# EAGLE design breakout (EAGLE 9.4.2)
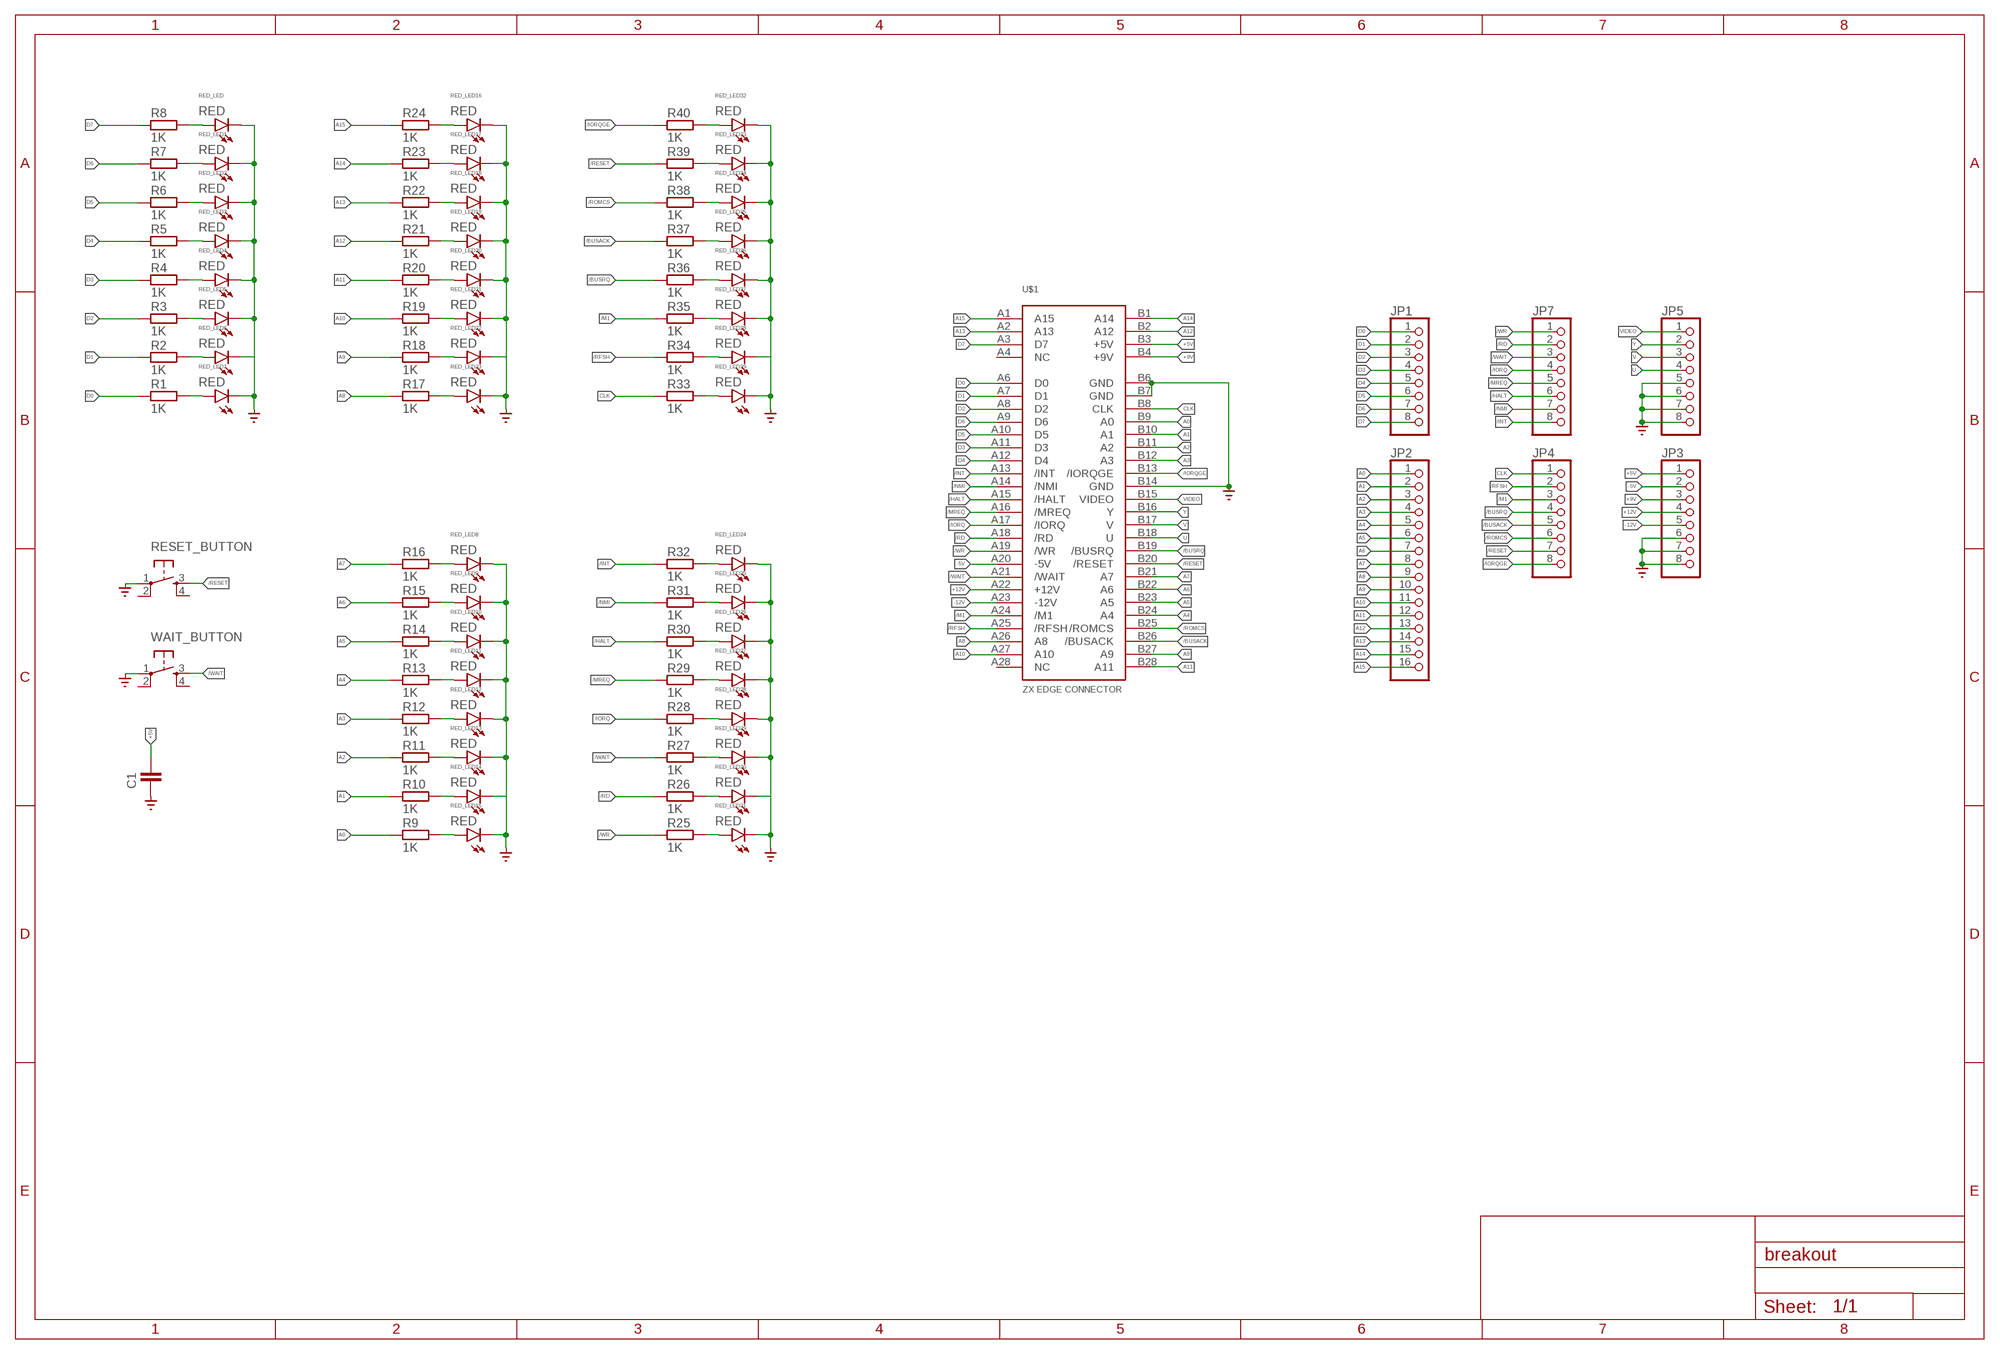
[diagram p0: schematic, sheet 1]

## Parts
C1  1u  C-EUC0402  [C0402]
JP1  PINHD-1X8  [1X08]
JP2  PINHD-1X16  [1X16]
JP3  PINHD-1X8  [1X08]
JP4  PINHD-1X8  [1X08]
JP5  PINHD-1X8  [1X08]
JP7  PINHD-1X8  [1X08]
R1  1K  R-EU_R0402  [R0402]
R2  1K  R-EU_R0402  [R0402]
R3  1K  R-EU_R0402  [R0402]
R4  1K  R-EU_R0402  [R0402]
R5  1K  R-EU_R0402  [R0402]
R6  1K  R-EU_R0402  [R0402]
R7  1K  R-EU_R0402  [R0402]
R8  1K  R-EU_R0402  [R0402]
R9  1K  R-EU_R0402  [R0402]
R10  1K  R-EU_R0402  [R0402]
R11  1K  R-EU_R0402  [R0402]
R12  1K  R-EU_R0402  [R0402]
R13  1K  R-EU_R0402  [R0402]
R14  1K  R-EU_R0402  [R0402]
R15  1K  R-EU_R0402  [R0402]
R16  1K  R-EU_R0402  [R0402]
R17  1K  R-EU_R0402  [R0402]
R18  1K  R-EU_R0402  [R0402]
R19  1K  R-EU_R0402  [R0402]
R20  1K  R-EU_R0402  [R0402]
R21  1K  R-EU_R0402  [R0402]
R22  1K  R-EU_R0402  [R0402]
R23  1K  R-EU_R0402  [R0402]
R24  1K  R-EU_R0402  [R0402]
R25  1K  R-EU_R0402  [R0402]
R26  1K  R-EU_R0402  [R0402]
R27  1K  R-EU_R0402  [R0402]
R28  1K  R-EU_R0402  [R0402]
R29  1K  R-EU_R0402  [R0402]
R30  1K  R-EU_R0402  [R0402]
R31  1K  R-EU_R0402  [R0402]
R32  1K  R-EU_R0402  [R0402]
R33  1K  R-EU_R0402  [R0402]
R34  1K  R-EU_R0402  [R0402]
R35  1K  R-EU_R0402  [R0402]
R36  1K  R-EU_R0402  [R0402]
R37  1K  R-EU_R0402  [R0402]
R38  1K  R-EU_R0402  [R0402]
R39  1K  R-EU_R0402  [R0402]
R40  1K  R-EU_R0402  [R0402]
RED_LED  RED  LEDCHIPLED_0603  [CHIPLED_0603]
RED_LED1  RED  LEDCHIPLED_0603  [CHIPLED_0603]
RED_LED2  RED  LEDCHIPLED_0603  [CHIPLED_0603]
RED_LED3  RED  LEDCHIPLED_0603  [CHIPLED_0603]
RED_LED4  RED  LEDCHIPLED_0603  [CHIPLED_0603]
RED_LED5  RED  LEDCHIPLED_0603  [CHIPLED_0603]
RED_LED6  RED  LEDCHIPLED_0603  [CHIPLED_0603]
RED_LED7  RED  LEDCHIPLED_0603  [CHIPLED_0603]
RED_LED8  RED  LEDCHIPLED_0603  [CHIPLED_0603]
RED_LED9  RED  LEDCHIPLED_0603  [CHIPLED_0603]
RED_LED10  RED  LEDCHIPLED_0603  [CHIPLED_0603]
RED_LED11  RED  LEDCHIPLED_0603  [CHIPLED_0603]
RED_LED12  RED  LEDCHIPLED_0603  [CHIPLED_0603]
RED_LED13  RED  LEDCHIPLED_0603  [CHIPLED_0603]
RED_LED14  RED  LEDCHIPLED_0603  [CHIPLED_0603]
RED_LED15  RED  LEDCHIPLED_0603  [CHIPLED_0603]
RED_LED16  RED  LEDCHIPLED_0603  [CHIPLED_0603]
RED_LED17  RED  LEDCHIPLED_0603  [CHIPLED_0603]
RED_LED18  RED  LEDCHIPLED_0603  [CHIPLED_0603]
RED_LED19  RED  LEDCHIPLED_0603  [CHIPLED_0603]
RED_LED20  RED  LEDCHIPLED_0603  [CHIPLED_0603]
RED_LED21  RED  LEDCHIPLED_0603  [CHIPLED_0603]
RED_LED22  RED  LEDCHIPLED_0603  [CHIPLED_0603]
RED_LED23  RED  LEDCHIPLED_0603  [CHIPLED_0603]
RED_LED24  RED  LEDCHIPLED_0603  [CHIPLED_0603]
RED_LED25  RED  LEDCHIPLED_0603  [CHIPLED_0603]
RED_LED26  RED  LEDCHIPLED_0603  [CHIPLED_0603]
RED_LED27  RED  LEDCHIPLED_0603  [CHIPLED_0603]
RED_LED28  RED  LEDCHIPLED_0603  [CHIPLED_0603]
RED_LED29  RED  LEDCHIPLED_0603  [CHIPLED_0603]
RED_LED30  RED  LEDCHIPLED_0603  [CHIPLED_0603]
RED_LED31  RED  LEDCHIPLED_0603  [CHIPLED_0603]
RED_LED32  RED  LEDCHIPLED_0603  [CHIPLED_0603]
RED_LED33  RED  LEDCHIPLED_0603  [CHIPLED_0603]
RED_LED34  RED  LEDCHIPLED_0603  [CHIPLED_0603]
RED_LED35  RED  LEDCHIPLED_0603  [CHIPLED_0603]
RED_LED36  RED  LEDCHIPLED_0603  [CHIPLED_0603]
RED_LED37  RED  LEDCHIPLED_0603  [CHIPLED_0603]
RED_LED38  RED  LEDCHIPLED_0603  [CHIPLED_0603]
RED_LED39  RED  LEDCHIPLED_0603  [CHIPLED_0603]
RESET_BUTTON  10-XX  [B3F-10XX-3D]
U$1  ZX-SPECTRUM-EDGE-CONNECTOR  [ZX-SPECTRUM-EDGE-CONNECTOR]
WAIT_BUTTON  10-XX  [B3F-10XX-3D]

## Nets
+5V: C1.1 JP3.1 U$1.B3(+5V)
+9V: JP3.3 U$1.B4(+9V)
+12V: JP3.4 U$1.A22(+12V)
-5V: JP3.2 U$1.A20(-5V)
-12V: JP3.5 U$1.A23(-12V)
/BUSACK: JP4.5 R37.1 U$1.B26(/BUSACK)
/BUSRQ: JP4.4 R36.1 U$1.B19(/BUSRQ)
/HALT: JP7.6 R30.1 U$1.A15(/HALT)
/INT: JP7.8 R32.1 U$1.A13(/INT)
/IORQ: JP7.4 R28.1 U$1.A17(/IORQ)
/IORQGE: JP4.8 R40.1 U$1.B13(/IORQGE)
/M1: JP4.3 R35.1 U$1.A24(/M1)
/MREQ: JP7.5 R29.1 U$1.A16(/MREQ)
/NMI: JP7.7 R31.1 U$1.A14(/NMI)
/RD: JP7.2 R26.1 U$1.A18(/RD)
/RESET: JP4.7 R39.1 RESET_BUTTON.3(S) U$1.B20(/RESET)
/RFSH: JP4.2 R34.1 U$1.A25(/RFSH)
/ROMCS: JP4.6 R38.1 U$1.B25(/ROMCS)
/WAIT: JP7.3 R27.1 U$1.A21(/WAIT) WAIT_BUTTON.3(S)
/WR: JP7.1 R25.1 U$1.A19(/WR)
A0: JP2.1 R9.1 U$1.B9(A0)
A1: JP2.2 R10.1 U$1.B10(A1)
A2: JP2.3 R11.1 U$1.B11(A2)
A3: JP2.4 R12.1 U$1.B12(A3)
A4: JP2.5 R13.1 U$1.B24(A4)
A5: JP2.6 R14.1 U$1.B23(A5)
A6: JP2.7 R15.1 U$1.B22(A6)
A7: JP2.8 R16.1 U$1.B21(A7)
A8: JP2.9 R17.1 U$1.A26(A8)
A9: JP2.10 R18.1 U$1.B27(A9)
A10: JP2.11 R19.1 U$1.A27(A10)
A11: JP2.12 R20.1 U$1.B28(A11)
A12: JP2.13 R21.1 U$1.B2(A12)
A13: JP2.14 R22.1 U$1.A2(A13)
A14: JP2.15 R23.1 U$1.B1(A14)
A15: JP2.16 R24.1 U$1.A1(A15)
CLK: JP4.1 R33.1 U$1.B8(CLK)
D0: JP1.1 R1.1 U$1.A6(D0)
D1: JP1.2 R2.1 U$1.A7(D1)
D2: JP1.3 R3.1 U$1.A8(D2)
D3: JP1.4 R4.1 U$1.A11(D3)
D4: JP1.5 R5.1 U$1.A12(D4)
D5: JP1.6 R6.1 U$1.A10(D5)
D6: JP1.7 R7.1 U$1.A9(D6)
D7: JP1.8 R8.1 U$1.A3(D7)
GND: C1.2 JP3.6 JP3.7 JP3.8 JP5.5 JP5.6 JP5.7 JP5.8 RED_LED1.C RED_LED2.C RED_LED3.C RED_LED4.C RED_LED5.C RED_LED6.C RED_LED7.C RED_LED8.C RED_LED9.C RED_LED10.C RED_LED11.C RED_LED12.C RED_LED13.C RED_LED14.C RED_LED15.C RED_LED16.C RED_LED17.C RED_LED18.C RED_LED19.C RED_LED20.C RED_LED21.C RED_LED22.C RED_LED23.C RED_LED24.C RED_LED25.C RED_LED26.C RED_LED27.C RED_LED28.C RED_LED29.C RED_LED30.C RED_LED31.C RED_LED32.C RED_LED33.C RED_LED34.C RED_LED35.C RED_LED36.C RED_LED37.C RED_LED38.C RED_LED39.C RED_LED.C RESET_BUTTON.1(P) U$1.B6(GND) U$1.B7(GND) U$1.B14(GND) WAIT_BUTTON.1(P) ; supply symbol labelled SUPPLY0_GND_
N$1: R8.2 RED_LED.A
N$2: R7.2 RED_LED1.A
N$3: R6.2 RED_LED2.A
N$4: R5.2 RED_LED3.A
N$5: R4.2 RED_LED4.A
N$6: R3.2 RED_LED5.A
N$7: R2.2 RED_LED6.A
N$8: R1.2 RED_LED7.A
N$9: R16.2 RED_LED8.A
N$10: R15.2 RED_LED9.A
N$11: R14.2 RED_LED10.A
N$12: R13.2 RED_LED11.A
N$13: R12.2 RED_LED12.A
N$14: R11.2 RED_LED13.A
N$15: R10.2 RED_LED14.A
N$16: R9.2 RED_LED15.A
N$17: R24.2 RED_LED16.A
N$18: R23.2 RED_LED17.A
N$19: R22.2 RED_LED18.A
N$20: R21.2 RED_LED19.A
N$21: R20.2 RED_LED20.A
N$22: R19.2 RED_LED21.A
N$23: R18.2 RED_LED22.A
N$24: R17.2 RED_LED23.A
N$25: R32.2 RED_LED24.A
N$26: R31.2 RED_LED25.A
N$27: R30.2 RED_LED26.A
N$28: R29.2 RED_LED27.A
N$29: R28.2 RED_LED28.A
N$30: R27.2 RED_LED29.A
N$31: R26.2 RED_LED30.A
N$32: R25.2 RED_LED31.A
N$33: R40.2 RED_LED32.A
N$34: R39.2 RED_LED33.A
N$35: R38.2 RED_LED34.A
N$36: R37.2 RED_LED35.A
N$37: R36.2 RED_LED36.A
N$38: R35.2 RED_LED37.A
N$39: R34.2 RED_LED38.A
N$40: R33.2 RED_LED39.A
U: JP5.4 U$1.B18(U)
V: JP5.3 U$1.B17(V)
VIDEO: JP5.1 U$1.B15(VIDEO)
Y: JP5.2 U$1.B16(Y)
Unconnected: RESET_BUTTON.2(P1) RESET_BUTTON.4(S1) U$1.A4(NC) U$1.A28(NC) WAIT_BUTTON.2(P1) WAIT_BUTTON.4(S1)

## Library data of the parts
C1 = resistors-scott:C-EU: CAPACITOR, European symbol; SPICEPREFIX: C
JP1 JP3-JP5 JP7 = pinhead:PINHD-1X8: PIN HEADER
JP2 = pinhead:PINHD-1X16: PIN HEADER
R1-R40 = rcl:R-EU_: RESISTOR, European symbol; SPICEPREFIX: R
RED_LED RED_LED1-RED_LED39 = led:LED: LED OSRAM: - CHIPLED LG R971, LG N971, LY N971, LG Q971, LY Q971, LO R971, LY R971 LH N974, LH R974 LS Q976, LO Q976, LY Q976 LO Q996 - Hyper CHIPLED LW Q18S LB Q993, LB Q99A, LB R99A - SideLED LS A670, LO A670, LY A670, LG A670, LP A670 LB A673, LV A673, LT A673, LW A673 LH A674 LY A675 LS A676, LA A676, LO A676, LY A676, LW A676 LS A679, LY A679, LG A679 - Hyper Micro SIDELED® LS Y876, LA Y876, LO Y876, LY Y876 LT Y87S - SmartLED LW L88C, LW L88S LB L89C, LB L89S, LG L890 LS L89K, LO L89K, LY L89K LS L896, LA L896, LO L896, LY L896 - TOPLED LS T670, LO T670, LY T670, LG T670, LP T670 LSG T670, LSP T670, LSY T670, LOP T670, LYG T670 LG T671, LOG T671, LSG T671 LB T673, LV T673, LT T673, LW T673 LH T674 LS T676, LA T676, LO T676, LY T676, LB T676, LH T676, LSB T676, LW T676 LB T67C, LV T67C, LT T67C, LS T67K, LO T67K, LY T67K, LW E67C LS E67B, LA E67B, LO E67B, LY E67B, LB E67C, LV E67C, LT E67C LW T67C LS T679, LY T679, LG T679 LS T770, LO T770, LY T770, LG T770, LP T770 LB T773, LV T773, LT T773, LW T773 LH T774 LS E675, LA E675, LY E675, LS T675 LS T776, LA T776, LO T776, LY T776, LB T776 LHGB T686 LT T68C, LB T68C - Hyper Mini TOPLED® LB M676 - Mini TOPLED Santana® LG M470 LS M47K, LO M47K, LY M47K Source: http://www.osram.convergy.de LUXEON: - LUMILED® LXK2-PW12-R00, LXK2-PW12-S00, LXK2-PW14-U00, LXK2-PW14-V00 LXK2-PM12-R00, LXK2-PM12-S00, LXK2-PM14-U00 LXK2-PE12-Q00, LXK2-PE12-R00, LXK2-PE12-S00, LXK2-PE14-T00, LXK2-PE14-U00 LXK2-PB12-K00, LXK2-PB12-L00, LXK2-PB12-M00, LXK2-PB14-N00, LXK2-PB14-P00, LXK2-PB14-Q00 LXK2-PR12-L00, LXK2-PR12-M00, LXK2-PR14-Q00, LXK2-PR14-R00 LXK2-PD12-Q00, LXK2-PD12-R00, LXK2-PD12-S00 LXK2-PH12-R00, LXK2-PH12-S00 LXK2-PL12-P00, LXK2-PL12-Q00, LXK2-PL12-R00 Source: www.luxeon.com KINGBRIGHT: KA-3528ASYC Source: www.kingbright.com
RESET_BUTTON WAIT_BUTTON = switch-omron:10-XX: OMRON SWITCH
U$1 = zx:ZX-SPECTRUM-EDGE-CONNECTOR

## Board
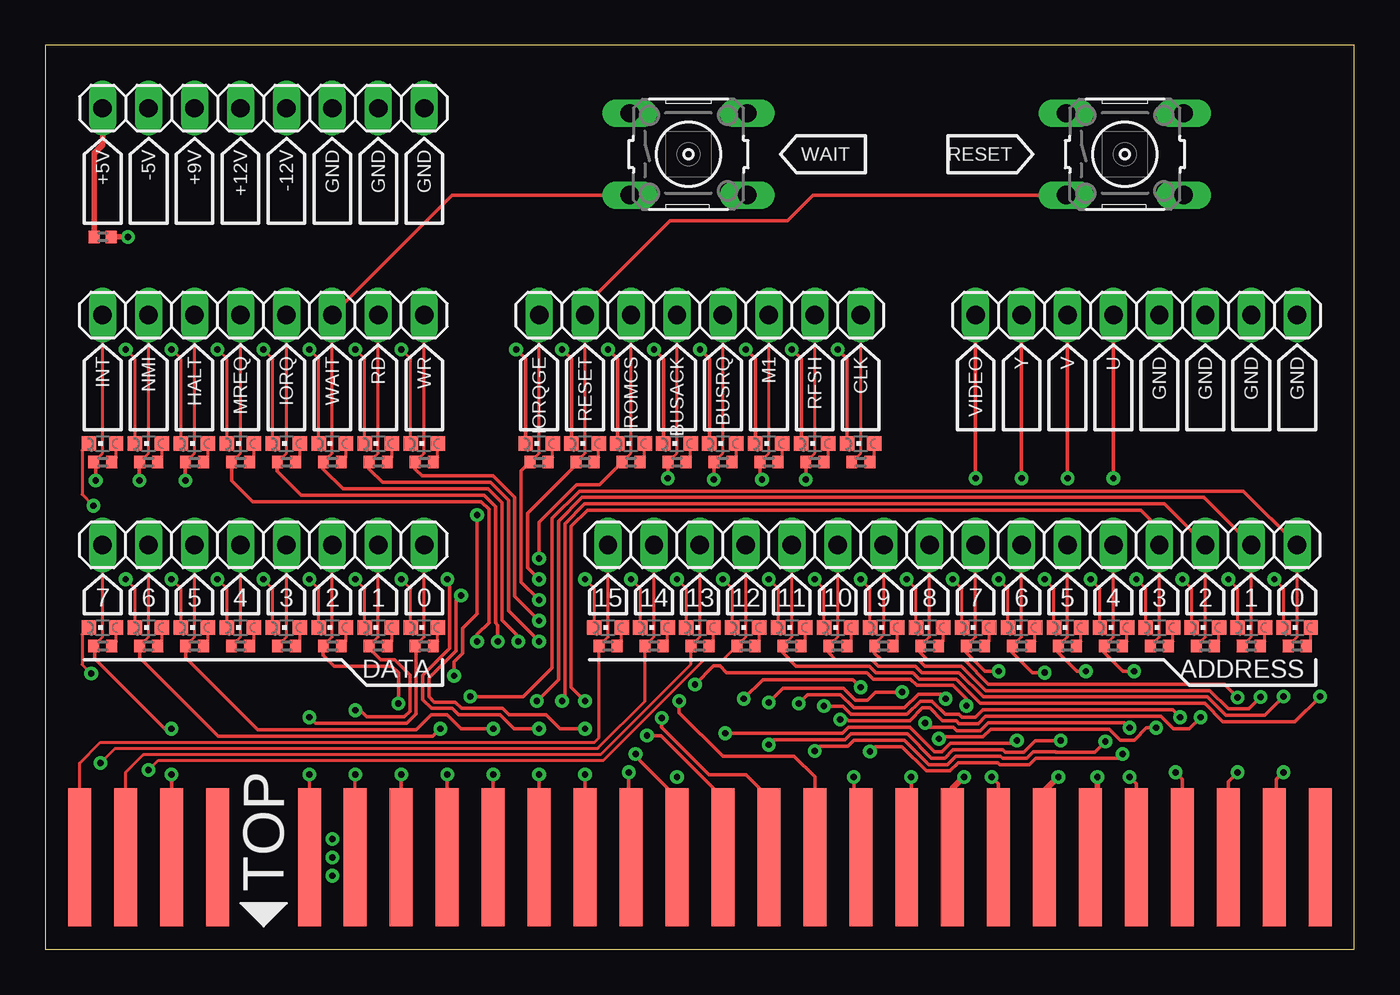
[diagram p1: board, top side]
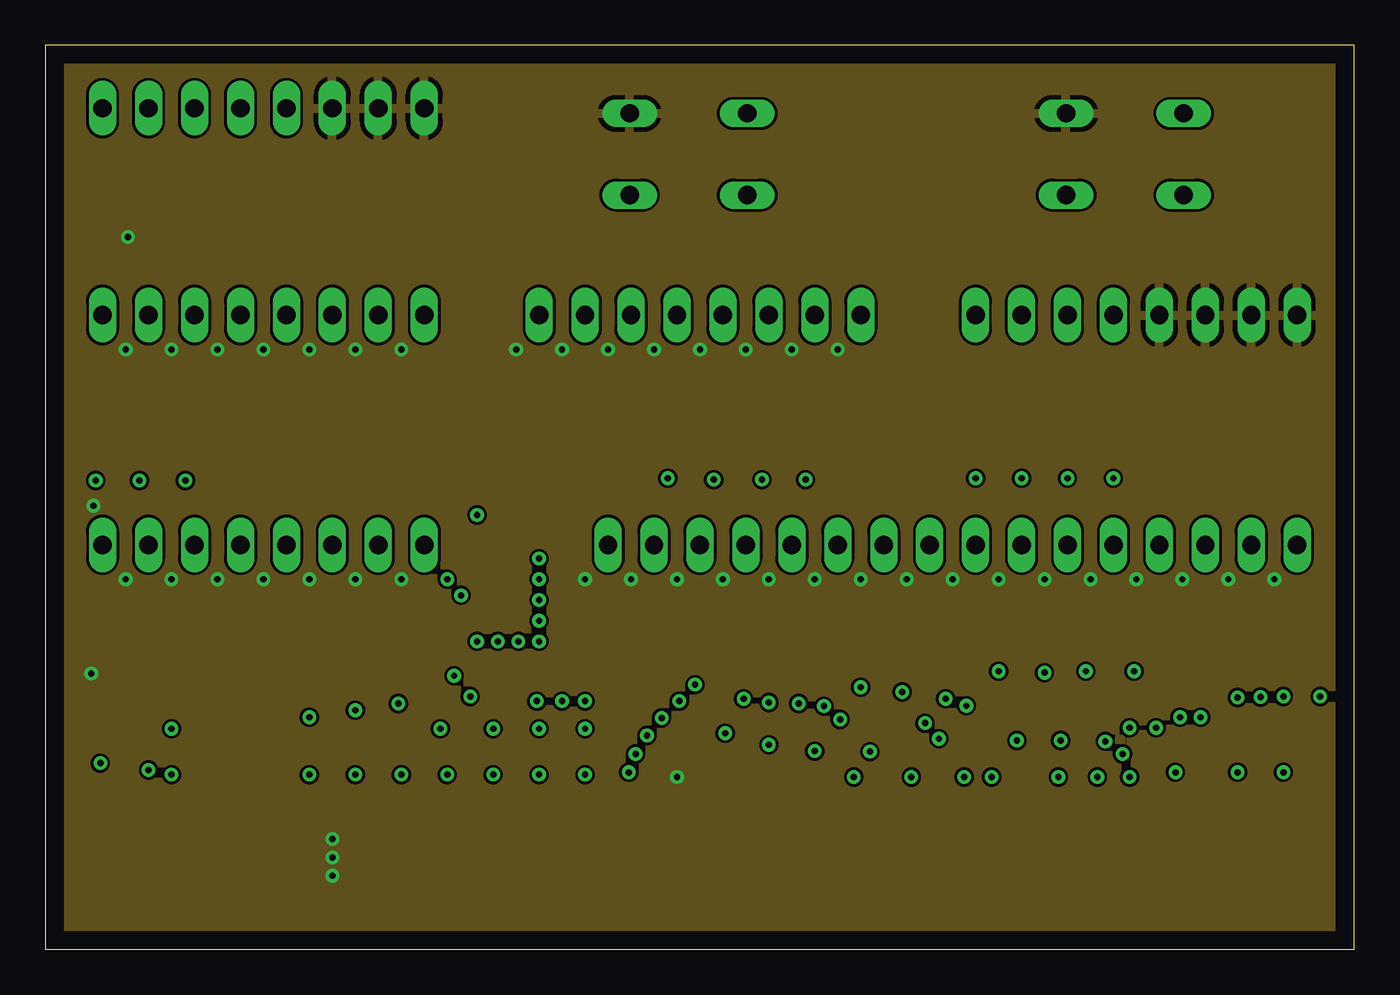
[diagram p2: board, inner layer Route2]
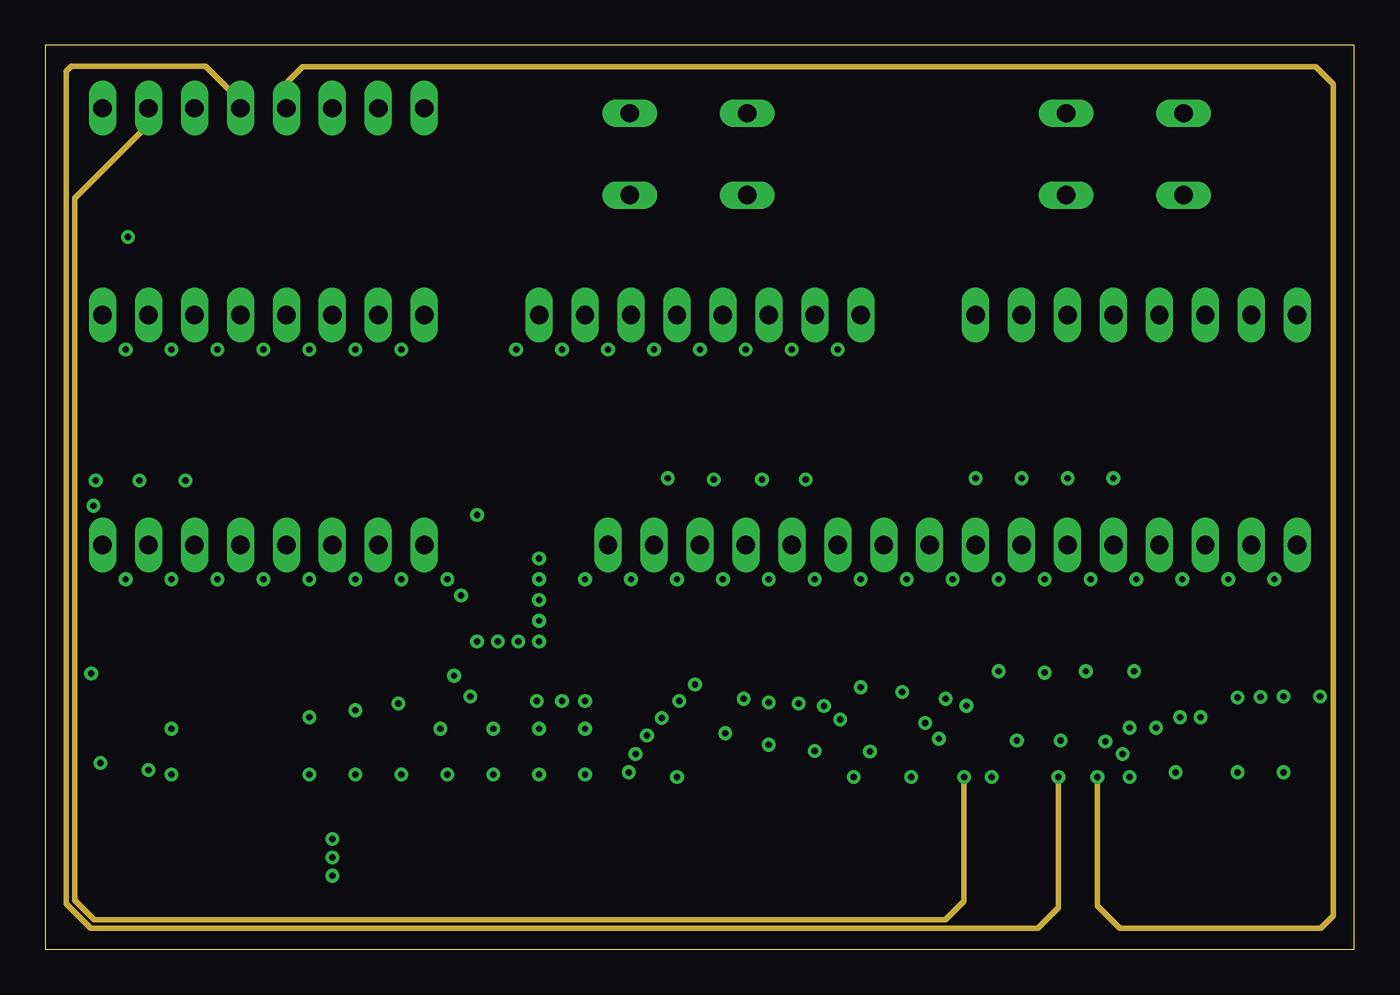
[diagram p3: board, inner layer Route15]
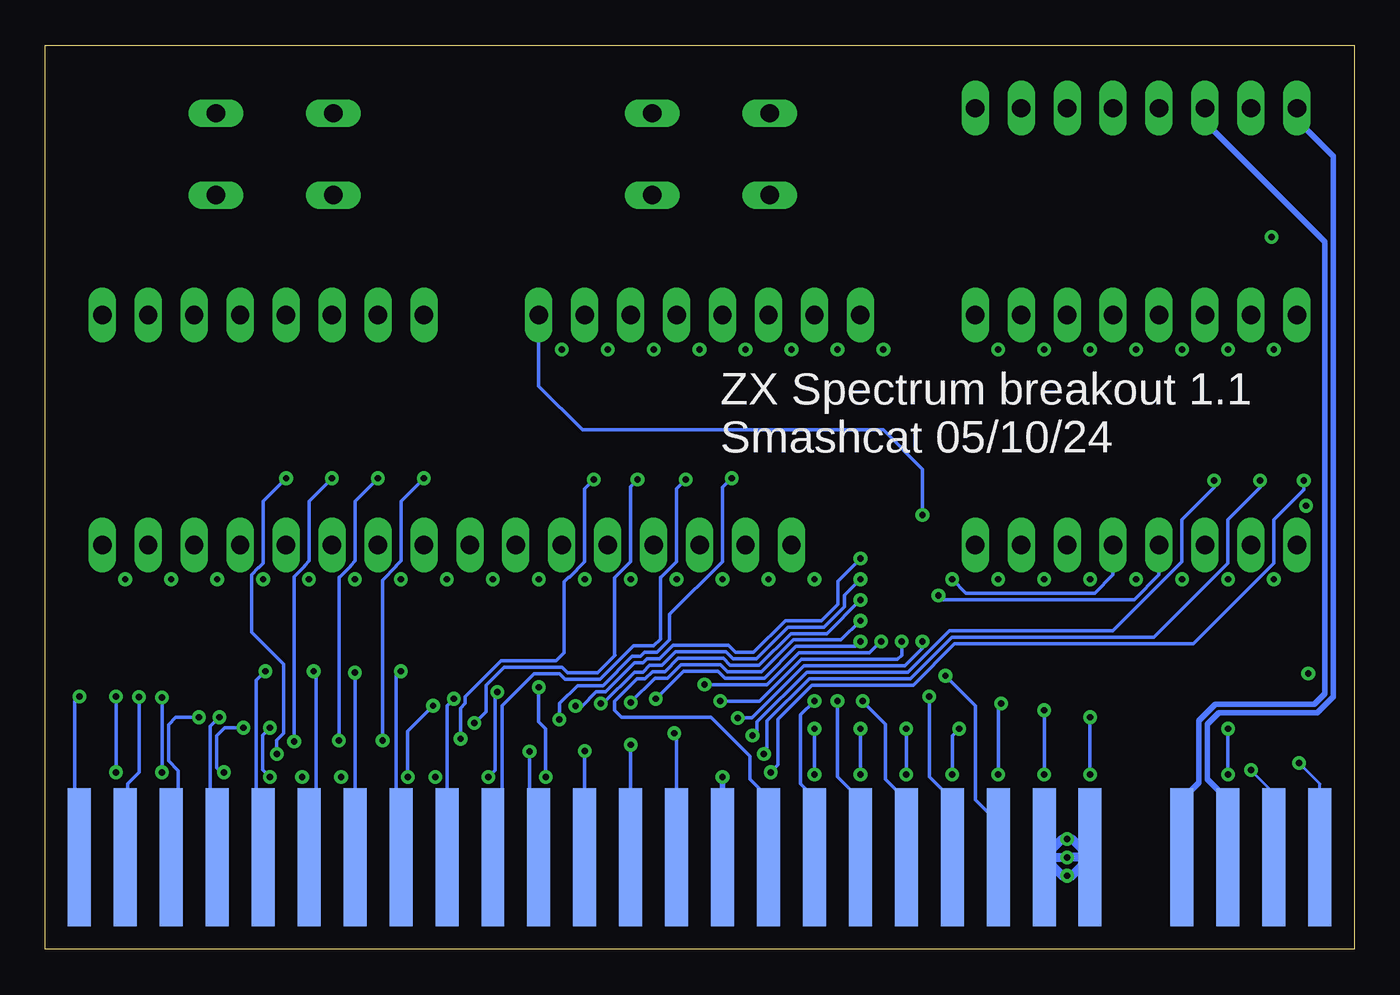
[diagram p4: board, bottom side, seen from below]

Size 72.37 x 49.96 mm. Coordinates in mm from the lower left corner, seen from the top.
Outline: 0,0 72.37,0 72.37,49.96 0,49.96 0,0
Copper layers (1+2*15+16): Top 0.035mm / dielectric 0.1mm / Route2 0.0175mm / dielectric 1.265mm / Route15 0.0175mm / dielectric 0.1mm / Bottom 0.035mm
Design rules "default *": minimum track width 6mil, minimum drill 0.35mm, track to track 6mil, track to pad 6mil, pad to pad 6mil, via to via 6mil, smd to smd 6mil, copper to edge 40mil, drill to drill 6mil, minimum pad ring 10mil, minimum via ring 8mil, stop-mask expansion 4mil, vias tented up to drill 0mil, thermal gap 10mil

### Footprints (pad centres in the part's own frame; a part is rotated, then mirrored left to right if it is on the bottom)
C0402 = smd 0.6 x 0.7: 1 -0.47,0; 2 0.47,0
1X08 = drill 1.016 long: 1 -8.89,0; 2 -6.35,0; 3 -3.81,0; 4 -1.27,0; 5 1.27,0; 6 3.81,0; 7 6.35,0; 8 8.89,0
1X16 = drill 1.016 long: 1 -19.05,0; 2 -16.51,0; 3 -13.97,0; 4 -11.43,0; 5 -8.89,0; 6 -6.35,0; 7 -3.81,0; 8 -1.27,0; 9 1.27,0; 10 3.81,0; 11 6.35,0; 12 8.89,0; 13 11.43,0; 14 13.97,0; 15 16.51,0; 16 19.05,0
R0402 = smd 0.6 x 0.7: 1 -0.5,0; 2 0.5,0
CHIPLED_0603 = smd 0.8 x 0.8: A 0,-0.75; C 0,0.75
B3F-10XX-3D = drill 1.016 long: 1 -3.251,2.261; 2 3.251,2.261; 3 -3.251,-2.261; 4 3.251,-2.261
ZX-SPECTRUM-EDGE-CONNECTOR = smd 1.27 x 7.62: A1 0,0; A2 2.54,0; A3 5.08,0; A4 7.62,0; A6 12.7,0; A7 15.24,0; A8 17.78,0; A9 20.32,0; A10 22.86,0; A11 25.4,0; A12 27.94,0; A13 30.48,0; A14 33.02,0; A15 35.56,0; A16 38.1,0; A17 40.64,0; A18 43.18,0; A19 45.72,0; A20 48.26,0; A21 50.8,0; A22 53.34,0; A23 55.88,0; A24 58.42,0; A25 60.96,0; A26 63.5,0; A27 66.04,0; A28 68.58,0 | smd 1.27 x 7.62 bottom: B1 0,0; B2 2.54,0; B3 5.08,0; B4 7.62,0; B6 12.7,0; B7 15.24,0; B8 17.78,0; B9 20.32,0; B10 22.86,0; B11 25.4,0; B12 27.94,0; B13 30.48,0; B14 33.02,0; B15 35.56,0; B16 38.1,0; B17 40.64,0; B18 43.18,0; B19 45.72,0; B20 48.26,0; B21 50.8,0; B22 53.34,0; B23 55.88,0; B24 58.42,0; B25 60.96,0; B26 63.5,0; B27 66.04,0; B28 68.58,0

### Placement (x,y rotation side)
C1  3.17,39.37 0 top
JP1  12.06,22.35 180 top
JP2  50.16,22.35 180 top
JP3  12.06,46.48 0 top
JP4  36.2,35.05 180 top
JP5  60.33,35.05 0 top
JP7  12.06,35.05 180 top
R1  20.95,16.76 0 top
R2  18.41,16.76 0 top
R3  15.88,16.76 0 top
R4  13.34,16.76 0 top
R5  10.79,16.76 0 top
R6  8.26,16.76 0 top
R7  5.71,16.76 0 top
R8  3.17,16.76 0 top
R9  69.22,16.76 0 top
R10  66.67,16.76 0 top
R11  64.14,16.76 0 top
R12  61.59,16.76 0 top
R13  59.05,16.76 0 top
R14  56.52,16.76 0 top
R15  53.98,16.76 0 top
R16  51.44,16.76 0 top
R17  48.9,16.76 0 top
R18  46.35,16.76 0 top
R19  43.81,16.76 0 top
R20  41.27,16.76 0 top
R21  38.73,16.76 0 top
R22  36.2,16.76 0 top
R23  33.66,16.76 0 top
R24  31.11,16.76 0 top
R25  20.95,26.92 0 top
R26  18.41,26.92 0 top
R27  15.88,26.92 0 top
R28  13.34,26.92 0 top
R29  10.79,26.92 0 top
R30  8.26,26.92 0 top
R31  5.71,26.92 0 top
R32  3.17,26.92 0 top
R33  45.09,26.92 0 top
R34  42.55,26.92 0 top
R35  40.01,26.92 0 top
R36  37.47,26.92 0 top
R37  34.92,26.92 0 top
R38  32.38,26.92 0 top
R39  29.84,26.92 0 top
R40  27.3,26.92 0 top
RED_LED  3.17,17.78 90 top
RED_LED1  5.71,17.78 90 top
RED_LED2  8.26,17.78 90 top
RED_LED3  10.79,17.78 90 top
RED_LED4  13.34,17.78 90 top
RED_LED5  15.88,17.78 90 top
RED_LED6  18.41,17.78 90 top
RED_LED7  20.95,17.78 90 top
RED_LED8  51.44,17.78 90 top
RED_LED9  53.98,17.78 90 top
RED_LED10  56.52,17.78 90 top
RED_LED11  59.05,17.78 90 top
RED_LED12  61.59,17.78 90 top
RED_LED13  64.14,17.78 90 top
RED_LED14  66.67,17.78 90 top
RED_LED15  69.22,17.78 90 top
RED_LED16  31.11,17.78 90 top
RED_LED17  33.66,17.78 90 top
RED_LED18  36.2,17.78 90 top
RED_LED19  38.73,17.78 90 top
RED_LED20  41.27,17.78 90 top
RED_LED21  43.81,17.78 90 top
RED_LED22  46.35,17.78 90 top
RED_LED23  48.9,17.78 90 top
RED_LED24  3.17,27.94 90 top
RED_LED25  5.71,27.94 90 top
RED_LED26  8.26,27.94 90 top
RED_LED27  10.79,27.94 90 top
RED_LED28  13.34,27.94 90 top
RED_LED29  15.88,27.94 90 top
RED_LED30  18.41,27.94 90 top
RED_LED31  20.95,27.94 90 top
RED_LED32  27.3,27.94 90 top
RED_LED33  29.84,27.94 90 top
RED_LED34  32.38,27.94 90 top
RED_LED35  34.92,27.94 90 top
RED_LED36  37.47,27.94 90 top
RED_LED37  40.01,27.94 90 top
RED_LED38  42.55,27.94 90 top
RED_LED39  45.09,27.94 90 top
RESET_BUTTON  59.69,43.94 0 top
U$1  1.91,5.08 0 top
WAIT_BUTTON  35.56,43.94 0 top

### Tracks (layer width: path | path; a pad name or v marks a point on that pad's centre or on a via)
+5V
  Top 0.305: C1.1 2.71,43.98 3.17,44.45 JP3.1
  Bottom 0.305: U$1.B3 6.99,8.26 8.13,9.4 8.13,12.45 7.49,13.08 2.03,13.08 1.17,13.95 1.17,43.84 3.17,45.85 JP3.1
+9V
  Bottom 0.305: U$1.B4 9.53,8.26 8.59,9.2 8.59,12.63 7.68,13.54 2.22,13.54 1.63,14.13 1.63,39.09 8.26,45.72 JP3.3
+12V  (via drill 0.35)
  Top 0.305: v56.01,9.53 55.24,8.76 U$1.A22
  Route15 0.305: JP3.4 10.79,46.86 8.86,48.79 1.45,48.79 1.17,48.51 1.17,2.52 2.52,1.17 54.89,1.17 56.01,2.29 v56.01,9.53
-5V  (via drill 0.35)
  Top 0.305: v50.8,9.53 50.16,8.89 U$1.A20
  Route15 0.305: JP3.2 5.71,45.59 1.63,41.5 1.63,2.7 2.7,1.63 49.76,1.63 50.8,2.67 v50.8,9.53
-12V  (via drill 0.35)
  Top 0.305: v58.17,9.53 58.17,5.46 U$1.A23
  Route15 0.305: JP3.5 13.34,47.88 14.22,48.77 70.23,48.77 71.2,47.8 71.2,1.86 70.51,1.17 59.41,1.17 58.17,2.41 v58.17,9.53
/BUSACK  (via drill 0.35)
  Top 0.178: R37.1 34.92,27.42 JP4.5
  Top 0.203: R37.1 v34.42,26.04 | v43.94,12.7 44.33,12.7 44.41,12.62 47.79,12.62 48.5,13.34 48.9,13.34 49.61,12.62 50.37,12.62 50.52,12.47 51.59,12.47 51.99,12.88 61.67,12.88 62.36,12.19 63.25,12.19 v63.88,12.83
  Bottom 0.203: v34.42,26.04 34.92,25.53 34.92,21.42 37.85,18.5 37.85,17.12 38.56,16.41 39.25,16.41 39.47,16.18 39.93,16.18 41.54,14.58 42.95,14.58 43.94,13.59 v43.94,12.7 | v63.88,12.83 65.15,12.83 65.56,12.42 65.56,10.41 65.02,9.88 65.02,5.46 U$1.B26
/BUSRQ  (via drill 0.35)
  Top 0.178: R36.1 37.47,27.42 JP4.4
  Top 0.203: R36.1 v36.97,25.96 v36.96,25.96
  Bottom 0.203: v36.96,25.96 37.47,25.45 37.47,21.42 38.31,20.57 38.35,20.57 38.35,17.14 38.73,16.76 39.86,16.76 41.69,14.93 43.63,14.93 43.94,15.24 45.34,15.24 47.12,13.46 47.12,8.76 47.62,8.26 U$1.B19
/HALT  (via drill 0.35)
  Top 0.178: R30.1 8.26,27.42 JP7.6
  Top 0.203: v7.75,25.91 7.75,26.92 R30.1 | U$1.A15 37.47,8.38 34.04,11.81 v33.27,11.81
  Bottom 0.203: v33.27,11.81 33.02,12.06 33.02,12.56 30.27,15.32 24.68,15.32 22.39,17.6 13.35,17.6 9.53,21.42 9.53,23.75 7.75,25.53 v7.75,25.91
/INT  (via drill 0.35)
  Top 0.178: R32.1 3.17,27.42 JP7.8
  Top 0.203: v32.26,9.78 32.26,5.21 U$1.A13 | R32.1 2.79,26.8 v2.79,25.91
  Bottom 0.203: v32.26,9.78 31.85,10.19 31.85,12.72 29.97,14.61 24.38,14.61 22.1,16.89 8.89,16.89 4.45,21.34 4.45,23.75 2.79,25.4 v2.79,25.91
/IORQ  (via drill 0.35)
  Top 0.178: R28.1 13.34,27.42 JP7.4
  Top 0.203: R28.1 12.84,26.41 14.15,25.09 24.26,25.09 24.89,24.46 24.89,18.04 25.02,17.91 v25.02,17.02 | U$1.A17 42.55,5.46 42.55,8.26 42.55,9.53 41.4,10.67 37.47,10.67 35.05,13.08 v35.05,13.72
  Bottom 0.203: v25.02,17.02 25.02,16.26 25.25,16.03 30.57,16.03 32.88,13.72 v35.05,13.72
/IORQGE  (via drill 0.35)
  Top 0.178: R40.1 27.3,27.42 JP4.8
  Top 0.203: R40.1 26.31,26.43 26.31,20.3 v27.3,19.3
  Bottom 0.203: v27.3,19.3 29.16,17.45 31.16,17.45 32.91,15.7 34.5,15.7 34.88,16.08 37.38,16.08 38.12,15.34 38.81,15.34 39.2,14.95 39.66,14.95 40.89,13.72 40.89,13.21 40.51,12.83 35.56,12.83 33.4,10.67 33.4,9.4 32.38,8.38 U$1.B13
/M1  (via drill 0.35)
  Top 0.178: R35.1 40.01,27.42 JP4.3
  Top 0.203: R35.1 39.51,26.07 v39.62,25.96 | v48.64,12.5 48.87,12.27 50.22,12.27 50.4,12.09 51.7,12.09 52.14,12.52 59.67,12.52 v59.94,12.25 | v59.94,9.53 60.33,9.14 U$1.A24
  Bottom 0.203: v39.62,25.96 40.01,25.57 40.01,21.42 40.89,20.53 40.89,16.26 40.88,16.24 41.84,15.29 43.49,15.29 43.8,15.6 47.02,15.6 48.01,14.61 48.01,13.13 v48.64,12.5 | v59.94,12.25 60.35,11.84 60.35,9.93 v59.94,9.53
/MREQ  (via drill 0.35)
  Top 0.178: R29.1 10.79,27.42 JP7.5
  Top 0.203: R29.1 10.29,25.9 11.46,24.74 24.11,24.74 24.54,24.31 24.54,18.06 23.88,17.4 v23.88,17.02 | v34.08,12.79 34.08,12.27 36.7,9.65 38.73,9.65 40.01,8.38 U$1.A16
  Bottom 0.203: v34.08,12.79 33.3,12.79 30.42,15.67 24.84,15.67 23.88,16.64 v23.88,17.02
/NMI  (via drill 0.35)
  Top 0.178: R31.1 5.71,27.42 JP7.7
  Top 0.203: v5.21,25.91 R31.1 | v32.64,10.79 32.64,10.67 34.61,8.7 34.92,8.38 U$1.A14
  Bottom 0.203: v32.64,10.79 32.46,10.97 32.46,12.62 30.12,14.96 24.53,14.96 22.25,17.25 11.07,17.25 7.62,20.7 7.62,20.71 7.25,21.08 7.24,21.08 6.99,21.34 6.99,23.75 5.21,25.53 v5.21,25.91
/RD  (via drill 0.35)
  Top 0.178: R26.1 18.41,27.42 JP7.2
  Top 0.203: R26.1 17.91,26.54 18.64,25.81 24.62,25.81 25.6,24.82 25.6,18.72 v27.3,17.02 | v38.61,13.84 39.67,14.91 44.66,14.91 v45.09,14.48 | v44.7,9.53 44.7,5.46 U$1.A18
  Bottom 0.203: v27.3,17.02 27.58,16.74 30.86,16.74 32.62,14.98 34.8,14.98 35.18,15.37 37.08,15.37 v38.61,13.84 | v45.09,14.48 45.09,12.57 44.7,12.19 v44.7,9.53
/RESET  (via drill 0.35)
  Top 0.178: R39.1 29.84,27.42 29.84,34.8 JP4.7
  Top 0.203: RESET_BUTTON.3 42.44,41.68 41.02,40.26 34.54,40.26 29.84,35.56 29.84,34.8 | v49.78,13.85 49.53,14.1 48.26,14.1 47.5,13.34 44.7,13.34 43.97,14.07 42.14,14.07 v41.66,13.59 | R39.1 29.34,26.78 26.67,24.11 26.67,21.08 v27.3,20.45
  Bottom 0.203: v27.3,20.45 28.19,19.56 28.19,18.92 29.31,17.8 31.3,17.8 33.06,16.05 34.35,16.05 34.74,16.43 37.53,16.43 38.26,15.7 38.95,15.7 39.33,15.32 39.79,15.32 41.52,13.59 v41.66,13.59 | v49.78,13.85 50.16,13.46 U$1.B20
/RFSH  (via drill 0.35)
  Top 0.178: R34.1 42.55,27.42 JP4.2
  Top 0.203: R34.1 v42.05,25.96 v42.04,25.96 | v49.4,11.64 49.5,11.73 51.85,11.73 52.28,12.17 58.83,12.17 59.44,11.56 60.2,11.56 60.89,12.25 v61.41,12.25 | v62.48,9.78 62.87,9.4 U$1.A25
  Bottom 0.203: v42.04,25.96 42.55,25.45 42.55,21.42 43.39,20.57 43.43,20.57 43.69,20.32 43.69,16.38 44.12,15.95 47.16,15.95 49.15,13.96 49.15,13.58 49.4,13.33 v49.4,11.64 | v61.41,12.25 62.46,12.25 62.89,11.81 62.89,10.03 62.64,9.78 v62.48,9.78
/ROMCS  (via drill 0.35)
  Top 0.178: R38.1 32.38,27.42 JP4.6
  Top 0.203: v43.05,13.44 44.1,13.44 44.56,12.98 47.65,12.98 48.38,13.72 49.02,13.72 49.76,12.98 50.52,12.98 50.66,12.83 51.44,12.83 51.84,13.23 62.33,13.23 v62.74,12.83 | R38.1 30.64,25.68 29.38,25.68 27.3,23.6 v27.3,21.59
  Bottom 0.203: v27.3,21.59 28.55,20.34 28.55,19.07 29.45,18.16 31.45,18.16 33.2,16.41 34.21,16.41 34.59,16.79 37.67,16.79 38.41,16.05 39.1,16.05 39.32,15.83 39.79,15.83 41.4,14.22 41.92,14.22 42.7,13.44 v43.05,13.44 | v62.74,12.83 63.25,12.32 63.25,5.46 U$1.B25
/WAIT  (via drill 0.35)
  Top 0.178: R27.1 15.88,27.42 JP7.3
  Top 0.203: WAIT_BUTTON.3 22.5,41.68 JP7.3 | v26.16,17.02 26.16,17.27 25.25,18.19 25.25,24.67 24.47,25.45 16.47,25.45 15.38,26.54 R27.1 | v52.33,9.53 52.7,9.15 U$1.A21 | v35.92,14.63 36.95,15.66 37.3,15.66 37.67,15.29 45.42,15.29 45.78,14.94 47.82,14.94 48.18,14.58 50.19,14.58 50.93,13.84 v50.93,13.46
  Bottom 0.203: v26.16,17.02 26.8,16.38 30.71,16.38 32.47,14.63 v35.92,14.63 | v50.93,13.46 52.35,12.04 52.35,9.55 v52.33,9.53
/WR  (via drill 0.35)
  Top 0.178: R25.1 20.95,27.42 JP7.1
  Top 0.203: R25.1 20.45,26.54 20.83,26.16 24.77,26.16 25.96,24.97 25.96,19.5 v27.3,18.16 | v40.01,13.64 40.79,14.43 44.14,14.43 44.8,13.77 45.47,13.77 45.9,14.2 47.35,14.2 v47.37,14.22 | v47.88,9.53 47.88,5.33 U$1.A19
  Bottom 0.203: v27.3,18.16 28.37,17.09 31.01,17.09 32.76,15.34 34.65,15.34 35.03,15.72 37.23,15.72 37.97,14.99 38.66,14.99 v40.01,13.64 | v47.37,14.22 47.5,14.1 47.5,9.91 v47.88,9.53
A0  (via drill 0.35)
  Top 0.178: R9.1 69.22,17.26 JP2.1
  Top 0.203: JP2.1 66.24,25.32 29.53,25.32 28.02,23.81 28.02,15.57 26.42,13.97 v23.5,13.97
  Bottom 0.203: U$1.B9 22.23,8.26 23.5,9.53 v23.5,13.97
A1  (via drill 0.35)
  Top 0.178: R10.1 66.67,17.26 JP2.2
  Top 0.203: JP2.2 64.06,24.97 29.68,24.97 28.37,23.66 28.37,14.91 v27.18,13.72
  Bottom 0.203: v27.18,13.72 25.91,12.45 25.91,9.4 24.77,8.26 U$1.B10
A2  (via drill 0.35)
  Top 0.178: R11.1 64.14,17.26 JP2.3
  Top 0.203: JP2.3 61.87,24.61 29.82,24.61 28.73,23.52 28.73,13.87 v28.57,13.72
  Bottom 0.203: v28.57,13.72 28.57,9.53 27.3,8.26 U$1.B11
A3  (via drill 0.35)
  Top 0.178: R12.1 61.59,17.26 JP2.4
  Top 0.203: JP2.4 61.59,23.24 60.58,24.26 29.97,24.26 29.08,23.37 29.08,14.48 v29.84,13.72
  Bottom 0.203: v29.84,13.72 30.61,12.95 30.61,9.14 29.84,8.38 U$1.B12
A4  (via drill 0.35)
  Top 0.178: R13.1 59.05,17.26 JP2.5
  Top 0.203: R13.1 58.55,16.38 59.56,15.37 v60.2,15.37
  Bottom 0.203: v60.2,15.37 60.71,14.86 60.71,5.46 U$1.B24
A5  (via drill 0.35)
  Top 0.178: R14.1 56.52,17.26 JP2.6
  Top 0.203: v57.53,15.37 57.02,15.37 56.02,16.38 R14.1
  Bottom 0.203: v57.53,15.37 57.4,15.24 57.4,5.46 U$1.B23
A6  (via drill 0.35)
  Top 0.178: R15.1 53.98,17.26 JP2.7
  Top 0.203: R15.1 53.48,16.38 54.57,15.29 v55.24,15.29
  Bottom 0.203: v55.24,15.29 U$1.B22
A7  (via drill 0.35)
  Top 0.178: R16.1 51.44,17.26 JP2.8
  Top 0.203: R16.1 50.94,16.38 51.94,15.37 v52.7,15.37
  Bottom 0.203: v52.7,15.37 52.96,15.11 52.96,5.33 U$1.B21
A8  (via drill 0.35)
  Top 0.178: R17.1 48.9,17.26 JP2.9
  Top 0.203: R17.1 48.4,16.38 48.77,16 50.8,16 52.15,14.66 65.17,14.66 v65.91,13.92 | v65.91,9.78 65.41,9.27 U$1.A26
  Bottom 0.203: v65.91,13.92 v65.91,9.78
A9  (via drill 0.35)
  Top 0.178: R18.1 45.85,16.89 46.35,17.39 JP2.10
  Top 0.203: R18.1 45.85,16.36 46.22,16 48.27,16 48.62,15.65 50.66,15.65 52,14.3 64.39,14.3 65.41,13.28 66.53,13.28 v67.18,13.94
  Bottom 0.203: v67.18,13.94 67.18,9.78 67.82,9.14 67.82,5.21 U$1.B27
A10  (via drill 0.35)
  Top 0.178: R19.1 43.81,17.26 JP2.11
  Top 0.203: R19.1 43.31,16.38 43.7,16 45.72,16 46.07,15.65 48.12,15.65 48.47,15.29 50.51,15.29 51.86,13.95 64.24,13.95 65.26,12.93 67.41,12.93 v68.45,13.97 | v68.45,9.78 68.07,9.4 68.07,5.21 U$1.A27
  Bottom 0.203: v68.45,13.97 v68.45,9.78
A11  (via drill 0.35)
  Top 0.178: R20.1 41.27,17.26 JP2.12
  Top 0.203: R20.1 40.77,16.38 41.5,15.65 45.57,15.65 45.92,15.29 47.97,15.29 48.33,14.94 50.36,14.94 51.71,13.59 64.09,13.59 65.11,12.57 69.09,12.57 v70.48,13.97
  Bottom 0.203: v70.48,13.97 70.74,13.72 70.74,5.33 U$1.B28
A12  (via drill 0.35)
  Top 0.178: JP2.13 38.73,17.26 R21.1 37.47,16 36.42,16 30.85,10.44 6.25,10.44 v5.71,9.91
  Bottom 0.178: U$1.B2 4.45,8.64 v5.71,9.91
A13
  Top 0.178: JP2.14 36.2,17.26 R22.1 35.7,15.75 30.72,10.77 5.44,10.77 4.45,9.78 U$1.A2
A14  (via drill 0.35)
  Top 0.178: JP2.15 33.66,17.26 R23.1 33.16,13.72 30.54,11.1 3.86,11.1 v3.05,10.29
  Bottom 0.178: U$1.B1 1.91,9.14 v3.05,10.29
A15
  Top 0.178: JP2.16 31.11,17.26 R24.1 30.61,11.68 30.36,11.43 3.05,11.43 1.91,10.29 U$1.A1
CLK  (via drill 0.35)
  Top 0.178: R33.1 45.09,27.42 JP4.1
  Top 0.203: v22.61,15.11 22.61,15.88 23.07,16.35 23.07,17.74 23.88,18.54 v23.88,24
  Bottom 0.203: U$1.B8 19.68,6.99 20.95,8.26 20.95,13.46 v22.61,15.11 | v23.88,24 23.88,26.54 26.04,28.7 42.67,28.7 45.09,31.11 JP4.1
D0  (via drill 0.35)
  Top 0.178: R1.1 20.52,16.82 20.95,17.26 JP1.1 | U$1.A6 v14.61,9.65
  Top 0.203: 20.52,16.82 20.52,13.01 19.98,12.48 14.95,12.48 v14.61,12.83
  Bottom 0.203: v14.61,9.65 v14.61,12.83
D1  (via drill 0.35)
  Top 0.178: R2.1 18.41,17.26 JP1.2 | U$1.A7 v17.14,9.65
  Top 0.203: v17.14,13.21 17.4,13.21 17.77,12.84 19.84,12.84 20.16,13.16 20.16,15.15 19.3,16 18.54,16 17.91,16.63 R2.1
  Bottom 0.203: v17.14,9.65 v17.14,13.21
D2  (via drill 0.35)
  Top 0.178: R3.1 15.88,17.26 JP1.3
  Top 0.203: U$1.A8 v19.68,9.65 | v19.53,13.59 19.53,15.28 19.16,15.65 15.98,15.65 15.38,16.25 R3.1
  Bottom 0.203: v19.68,9.65 19.68,13.43 v19.53,13.59
D3  (via drill 0.35)
  Top 0.178: R4.1 13.34,17.26 JP1.4
  Top 0.203: U$1.A11 v27.3,9.65 | v27.3,12.19 25.91,12.19 25.15,12.95 22.86,12.95 22.5,13.31 21.36,13.31 20.87,13.8 20.87,15.15 22.35,16.64 22.35,17.27 22.36,17.27 22.36,20.31 v22.23,20.45
  Bottom 0.203: v27.3,9.65 v27.3,12.19 | v22.23,20.45 21.46,19.68 14.35,19.68 13.34,20.7 JP1.4
D4  (via drill 0.35)
  Top 0.178: R5.1 10.79,17.26 JP1.5
  Top 0.203: U$1.A12 v29.84,9.65 | v29.84,12.19 28.45,12.19 27.69,12.95 25.65,12.95 25.29,13.31 23.01,13.31 22.65,13.66 21.51,13.66 21.23,13.95 21.23,15.01 22.71,16.49 22.71,17.12 22.71,17.13 22.71,19.28 v22.99,19.56
  Bottom 0.203: v29.84,9.65 v29.84,12.19 | v22.99,19.56 22.76,19.33 12.17,19.33 10.79,20.7 JP1.5
D5  (via drill 0.35)
  Top 0.178: R6.1 8.26,17.26 JP1.6
  Top 0.203: U$1.A10 v24.77,9.65 | R6.1 7.75,16.12 11.74,12.13 20.51,12.13 21.34,12.95 22.23,12.95 22.99,12.19 v24.77,12.19
  Bottom 0.203: v24.77,9.65 v24.77,12.19
D6  (via drill 0.35)
  Top 0.178: R7.1 5.71,17.26 JP1.7
  Top 0.203: U$1.A9 v22.23,9.65 | v21.84,12.19 21.43,11.77 9.56,11.77 5.21,16.12 R7.1
  Bottom 0.203: v22.23,9.65 22.23,11.81 v21.84,12.19
D7  (via drill 0.35)
  Top 0.178: R8.1 2.73,16.82 3.17,17.26 JP1.8
  Top 0.203: U$1.A3 v6.99,9.65 | v6.99,12.19 6.6,12.19 2.73,16.06 2.73,16.82
  Bottom 0.203: v6.99,9.65 v6.99,12.19
GND  (via drill 0.35)
  Top 0.178: v2.54,15.24 2.04,15.74 2.04,17.4 RED_LED.C | RED_LED1.C 4.96,19.93 v4.45,20.45 | RED_LED2.C 7.5,19.93 v6.99,20.45 | RED_LED3.C 10.04,19.93 v9.53,20.45 | RED_LED4.C 12.59,19.93 v12.06,20.45 | RED_LED5.C 15.12,19.93 v14.61,20.45 | RED_LED6.C 17.66,19.93 v17.14,20.45 | RED_LED7.C 20.2,19.93 v19.68,20.45 | RED_LED24.C 2.04,27.56 2.04,25.13 v2.67,24.51 | RED_LED25.C 4.96,32.63 v4.45,33.15 | RED_LED26.C 7.5,32.63 v6.99,33.15 | RED_LED27.C 10.04,32.63 v9.53,33.15 | RED_LED28.C 12.59,32.63 v12.06,33.15 | RED_LED29.C 15.12,32.63 v14.61,33.15 | RED_LED30.C 17.66,32.63 v17.14,33.15 | RED_LED31.C 20.2,32.63 v19.68,33.15 | RED_LED16.C 30.36,19.93 v29.84,20.45 | RED_LED17.C 32.91,19.93 v32.38,20.45 | RED_LED18.C 35.45,19.93 v34.92,20.45 | RED_LED19.C 37.98,19.93 v37.47,20.45 | RED_LED20.C 40.52,19.93 v40.01,20.45 | RED_LED21.C 43.06,19.93 v42.55,20.45 | RED_LED22.C 45.6,19.93 v45.09,20.45 | RED_LED23.C 48.15,19.93 v47.62,20.45 | RED_LED8.C 50.69,19.93 v50.16,20.45 | RED_LED9.C 53.23,19.93 v52.7,20.45 | RED_LED10.C 55.77,19.93 v55.24,20.45 | RED_LED11.C 58.3,19.93 v57.78,20.45 | RED_LED12.C 60.84,19.93 v60.33,20.45 | RED_LED13.C 63.38,19.93 v62.87,20.45 | RED_LED14.C 65.92,19.93 v65.41,20.45 | RED_LED15.C 68.47,19.93 v67.94,20.45
  Top 0.203: RED_LED32.C 26.55,32.63 v26.04,33.15 | RED_LED33.C 29.09,32.63 v28.57,33.15 | RED_LED34.C 31.64,32.63 v31.11,33.15 | RED_LED35.C 34.17,32.63 v33.66,33.15 | RED_LED36.C 36.72,32.63 v36.2,33.15 | RED_LED37.C 39.26,32.63 v38.73,33.15 | RED_LED38.C 41.8,32.63 v41.27,33.15 | RED_LED39.C 44.34,32.63 v43.81,33.15
  Top 0.305: C1.2 v4.57,39.37
  Bottom 0.305: U$1.B14 v34.92,9.53
  Bottom 0.508: U$1.B6 15.62,6.1 v15.88,6.1 16.13,6.1 U$1.B7 | U$1.B6 15.62,4.06 v15.88,4.06 16.13,4.06 U$1.B7 | U$1.B6 v15.88,5.08 U$1.B7
  pour Route2: -2.54,53.34 76.2,53.34 76.2,-2.54 -2.54,-2.54
N$1
  Top 0.178: R8.2 3.92,17.01 RED_LED.A
N$2
  Top 0.178: R7.2 6.46,17.01 RED_LED1.A
N$3
  Top 0.178: R6.2 9.01,17.01 RED_LED2.A
N$4
  Top 0.178: R5.2 11.54,17.01 RED_LED3.A
N$5
  Top 0.178: R4.2 14.09,17.01 RED_LED4.A
N$6
  Top 0.178: R3.2 16.62,17.01 RED_LED5.A
N$7
  Top 0.178: R2.2 19.16,17.01 RED_LED6.A
N$8
  Top 0.178: R1.2 21.7,17.01 RED_LED7.A
N$9
  Top 0.178: R16.2 52.19,17.01 RED_LED8.A
N$10
  Top 0.178: R15.2 54.73,17.01 RED_LED9.A
N$11
  Top 0.178: R14.2 57.27,17.01 RED_LED10.A
N$12
  Top 0.178: R13.2 59.8,17.01 RED_LED11.A
N$13
  Top 0.178: R12.2 62.34,17.01 RED_LED12.A
N$14
  Top 0.178: R11.2 64.89,17.01 RED_LED13.A
N$15
  Top 0.178: R10.2 67.42,17.01 RED_LED14.A
N$16
  Top 0.178: R9.2 69.97,17.01 RED_LED15.A
N$17
  Top 0.178: R24.2 31.86,17.01 RED_LED16.A
N$18
  Top 0.178: R23.2 34.41,17.01 RED_LED17.A
N$19
  Top 0.178: R22.2 36.95,17.01 RED_LED18.A
N$20
  Top 0.178: R21.2 39.48,17.01 RED_LED19.A
N$21
  Top 0.178: R20.2 42.02,17.01 RED_LED20.A
N$22
  Top 0.178: R19.2 44.56,17.01 RED_LED21.A
N$23
  Top 0.178: R18.2 47.1,17.01 RED_LED22.A
N$24
  Top 0.178: R17.2 49.65,17.01 RED_LED23.A
N$25
  Top 0.178: R32.2 3.92,27.17 RED_LED24.A
N$26
  Top 0.178: R31.2 6.46,27.17 RED_LED25.A
N$27
  Top 0.178: R30.2 9.01,27.17 RED_LED26.A
N$28
  Top 0.178: R29.2 11.54,27.17 RED_LED27.A
N$29
  Top 0.178: R28.2 14.09,27.17 RED_LED28.A
N$30
  Top 0.178: R27.2 16.62,27.17 RED_LED29.A
N$31
  Top 0.178: R26.2 19.16,27.17 RED_LED30.A
N$32
  Top 0.178: R25.2 21.7,27.17 RED_LED31.A
N$33
  Top 0.178: R40.2 28.05,27.17 RED_LED32.A
N$34
  Top 0.178: R39.2 30.59,27.17 RED_LED33.A
N$35
  Top 0.178: R38.2 33.13,27.17 RED_LED34.A
N$36
  Top 0.178: R37.2 35.67,27.17 RED_LED35.A
N$37
  Top 0.178: R36.2 38.22,27.17 RED_LED36.A
N$38
  Top 0.178: R35.2 40.76,27.17 RED_LED37.A
N$39
  Top 0.178: R34.2 43.3,27.17 RED_LED38.A
N$40
  Top 0.178: R33.2 45.84,27.17 RED_LED39.A
U  (via drill 0.35)
  Top 0.203: JP5.4 v59.05,26.04 | v59.56,10.79 59.31,10.55 54.76,10.55 54.4,10.19 52.78,10.19 52.66,10.31 50.48,10.31 50.02,9.86 48.71,9.86 47.36,11.2 45.87,11.2 v45.59,10.93
  Bottom 0.203: v59.05,26.04 60.33,24.77 60.33,21.34 60.58,21.08 60.59,21.08 60.96,20.71 60.96,20.7 60.96,17.53 59.18,15.75 59.18,11.94 59.56,11.56 v59.56,10.79 | U$1.B18 45.09,8.26 45.59,8.76 v45.59,10.93
V  (via drill 0.35)
  Top 0.203: JP5.3 v56.52,26.04 | v58.61,11.49 58.02,10.9 55.87,10.9 55.85,10.92 54.63,10.92 54.26,10.55 52.93,10.55 52.81,10.67 50.34,10.67 49.88,10.21 48.85,10.21 47.51,11.56 44.7,11.56 44.37,11.23 42.82,11.23 v42.55,10.95
  Bottom 0.203: v56.52,26.04 57.78,24.77 57.78,21.46 58.04,21.21 58.04,21.17 58.61,20.6 v58.61,11.49 | v42.55,10.95 U$1.B17
VIDEO  (via drill 0.35)
  Top 0.203: JP5.1 v51.44,26.04 | v53.72,11.53 53.57,11.38 50.04,11.38 49.58,10.92 49.15,10.92 47.8,12.27 44.4,12.27 44.07,11.94 v37.59,11.94
  Bottom 0.203: v51.44,26.04 52.7,24.77 52.7,21.46 52.96,21.21 52.96,21.17 53.72,20.41 v53.72,11.53 | U$1.B15 37.47,11.81 v37.59,11.94
Y  (via drill 0.35)
  Top 0.203: JP5.2 v53.98,26.04 | v56.13,11.53 54.74,11.53 54.11,10.9 53.08,10.9 52.96,11.02 50.19,11.02 49.73,10.57 49,10.57 47.66,11.91 44.55,11.91 44.22,11.58 40.28,11.58 v40.01,11.3
  Bottom 0.203: v53.98,26.04 55.24,24.77 55.24,21.46 55.5,21.21 55.5,21.17 56.09,20.57 56.13,20.57 v56.13,11.53 | U$1.B16 v40.01,11.3

### Text on the board
tPlace: +5V | -5V | +9V | +12V | -12V | GND | GND | GND | WAIT | RESET | INT | NMI | HALT | MREQ | IORQ | WAIT | RD | WR | IORQGE | RESET | ROMCS | BUSACK | BUSRQ | M1 | RFSH | CLK | VIDEO | Y | V | U | GND | GND | GND | GND | 7 | 6 | 5 | 4 | 3 | 2 | 1 | 0 | 15 | 14 | 13 | 12 | 11 | 10 | 9 | 8 | 7 | 6 | 5 | 4 | 3 | 2 | 1 | 0 | DATA | ADDRESS
bPlace: ZX Spectrum breakout 1.1 / Smashcat 05/10/24